# EasyEDA Pro project ProPrj_nrf52833_LighthouseTag_2025-07-26.epro, board PCB18_3
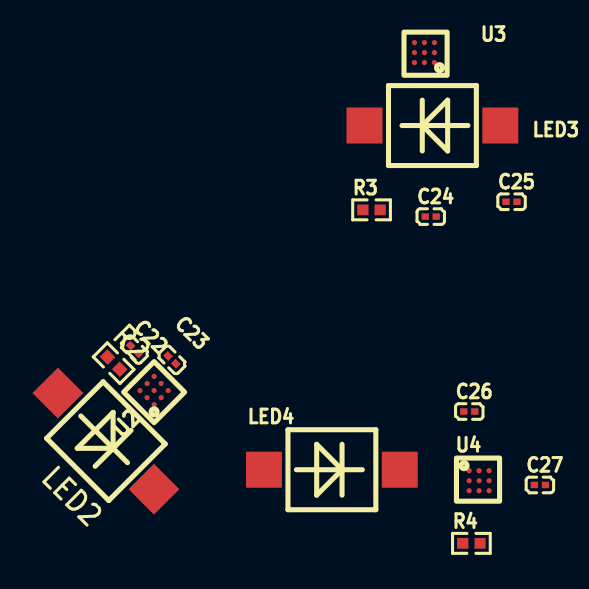
[diagram p11: board, top side]
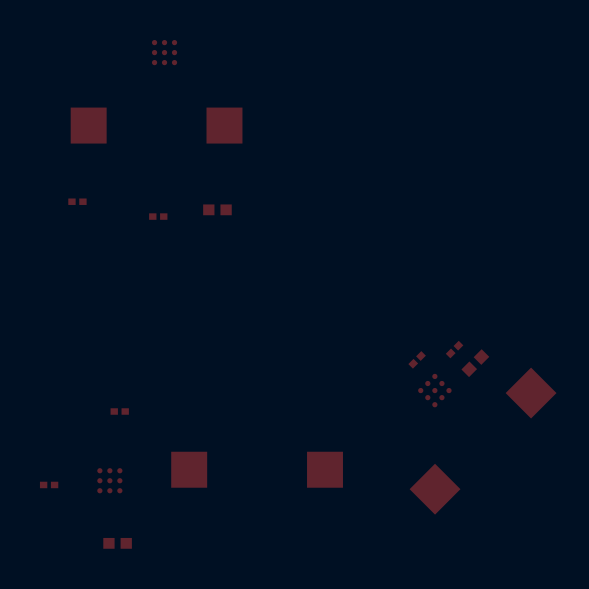
[diagram p12: board, bottom side, seen from below]

No outline. copper layers: Top Layer, Bottom Layer. Coordinates in mm from the lowest, leftmost part position.
Stack: Top Layer 0.035mm / Dielectric1 1.51mm FR4 er 4.5 / Bottom Layer 0.035mm

## Design rules (mm)
template: 用户自定义配置
spacing safeClearance (default): track to track 0.152, other pairs 0.152 to 0.3
track width trackWidth (default): min 0.127, default 0.203, max 1.27
differential pair differentialPair (default): width min 0.127, default 0.254, max 2.54; gap min 0.152, default 0.152
via viaSize (default): diameter min 0.5, default 0.61, max 10; hole min 0.3, default 0.305, max 5.999

## Placement (name value [footprint] x y rotation side)
C22  1uF  [C0201]  1.43 9.69 135 top
C23  100nF  [C0201]  3.3 9.18 135 top
C24  1uF  [C0201]  16.26 16.35 0 top
C25  100nF  [C0201]  20.31 17.09 0 top
C26  1uF  [C0201]  18.19 6.6 0 top
C27  100nF  [C0201]  21.73 2.92 0 top
LED2  VBPW34S  [SENSOR-SMD_L4.4-W3.9]  0 5.11 315 top
LED3  VBPW34S  [SENSOR-SMD_L4.4-W3.9]  16.35 20.9 180 top
LED4  VBPW34S  [SENSOR-SMD_L4.4-W3.9]  11.31 3.68 0 top
R2  15kΩ  [R0402]  0.39 9.01 315 top
R3  15kΩ  [R0402]  13.3 16.68 0 top
R4  15kΩ  [R0402]  18.3 0 0 top
U2  -  [TS4231]  2.41 7.65 135 top
U3  -  [TS4231]  15.94 24.56 180 top
U4  -  [TS4231]  18.69 3.12 0 top

## Footprints (pads in the part's own frame, mm; a bottom-side part is the same pattern mirrored in y, then rotated)
C0201
  rect 0.368x0.324 smd: 1(-0.275,0) 2(0.275,0)
R0402
  rect 0.566x0.54 smd: 1(-0.433,0) 2(0.433,0)
SENSOR-SMD_L4.4-W3.9
  rect 1.8x1.8 smd: 1(-3.4,0) 2(3.4,0)
TS4231
  round 0.262 smd: 1(-0.508,0.508) 2(-0.008,0.508) 3(0.492,0.508) 4(-0.508,0.008) 5(-0.008,0.008) 6(0.492,0.008) 7(-0.508,-0.492) 8(-0.008,-0.492) 9(0.492,-0.492)

## Nets
As in the schematic.

Pads without a net: U2 1 3 4 6 8; U4 1 3 4 6 8
